# Altium project link_b.PrjPcb
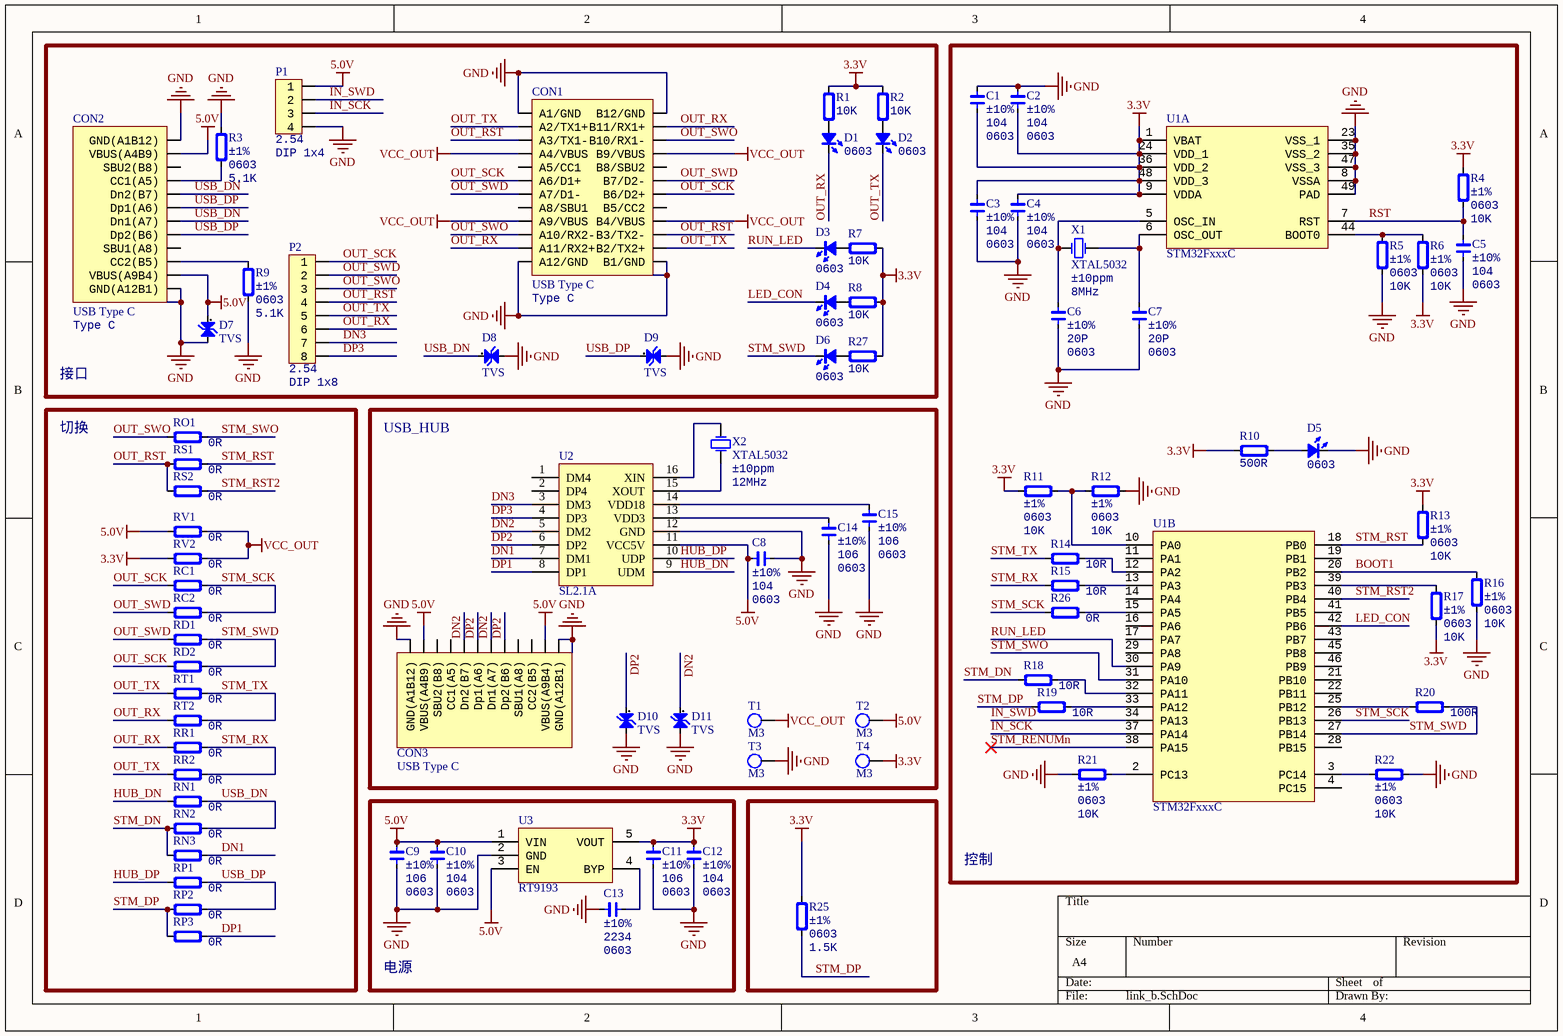
[diagram p0: link_b.SchDoc]
1 sheet, 84 parts. Net scope: global (net labels, ports and power ports of the same name join across sheets).
Board file: link_b.PcbDoc

## Sheet link_b.SchDoc
size A4

### Parts
C1  value 104  Note: ±10%  Type: 0603  [CAP_0603]  (hidden comment: C0603)
C2  value 104  Note: ±10%  Type: 0603  [CAP_0603]  (hidden comment: C0603)
C3  value 104  Note: ±10%  Type: 0603  [CAP_0603]  (hidden comment: C0603)
C4  value 104  Note: ±10%  Type: 0603  [CAP_0603]  (hidden comment: C0603)
C5  value 104  Note: ±10%  Type: 0603  [CAP_0603]  (hidden comment: C0603)
C6  value 20P  Note: ±10%  Type: 0603  [CAP_0603]  (hidden comment: C0603)
C7  value 20P  Note: ±10%  Type: 0603  [CAP_0603]  (hidden comment: C0603)
C8  value 104  Note: ±10%  Type: 0603  [CAP_0603]  (hidden comment: C0603)
C9  value 106  Note: ±10%  Type: 0603  [CAP_0603]  (hidden comment: C0603)
C10  value 104  Note: ±10%  Type: 0603  [CAP_0603]  (hidden comment: C0603)
C11  value 106  Note: ±10%  Type: 0603  [CAP_0603]  (hidden comment: C0603)
C12  value 104  Note: ±10%  Type: 0603  [CAP_0603]  (hidden comment: C0603)
C13  value 2234  Note: ±10%  Type: 0603  [CAP_0603]  (hidden comment: C0603)
C14  value 106  Note: ±10%  Type: 0603  [CAP_0603]  (hidden comment: C0603)
C15  value 106  Note: ±10%  Type: 0603  [CAP_0603]  (hidden comment: C0603)
CON1  USB Type C  value Type C  [USB_TypeC_SMD_24P]
CON2  USB Type C  value Type C  [USB_TypeC_SMD_16P]
CON3  USB Type C  [USB_TypeC_SMD_16P]
D1  Type: 0603  [LED_0603_RED]  (hidden comment: D0603)
D2  Type: 0603  [LED_0603_RED]  (hidden comment: D0603)
D3  Type: 0603  [LED_0603_RED]  (hidden comment: D0603)
D4  Type: 0603  [LED_0603_RED]  (hidden comment: D0603)
D5  Type: 0603  [LED_0603_RED]  (hidden comment: D0603)
D6  Type: 0603  [LED_0603_RED]  (hidden comment: D0603)
D7  TVS  [LED_0603_YELLOW]
D8  TVS  [LED_0603_YELLOW]
D9  TVS  [LED_0603_YELLOW]
D10  TVS  [LED_0603_YELLOW]
D11  TVS  [LED_0603_YELLOW]
P1  value 2.54  Type: DIP 1x4  [HDR1x4_TOP]  (hidden comment: HDR1x4)
P2  value 2.54  Type: DIP 1x8  [HDR1x8_TOP]  (hidden comment: HDR1x8)
R1  value 10K  [RES_0603]  (hidden comment: R0603)
R2  value 10K  [RES_0603]  (hidden comment: R0603)
R3  value 5.1K  Note: ±1%  Type: 0603  [RES_0603]  (hidden comment: R0603)
R4  value 10K  Note: ±1%  Type: 0603  [RES_0603]  (hidden comment: R0603)
R5  value 10K  Note: ±1%  Type: 0603  [RES_0603]  (hidden comment: R0603)
R6  value 10K  Note: ±1%  Type: 0603  [RES_0603]  (hidden comment: R0603)
R7  value 10K  [RES_0603]  (hidden comment: R0603)
R8  value 10K  [RES_0603]  (hidden comment: R0603)
R9  value 5.1K  Note: ±1%  Type: 0603  [RES_0603]  (hidden comment: R0603)
R10  value 500R  [RES_0603]  (hidden comment: R0603)
R11  value 10K  Note: ±1%  Type: 0603  [RES_0603]  (hidden comment: R0603)
R12  value 10K  Note: ±1%  Type: 0603  [RES_0603]  (hidden comment: R0603)
R13  value 10K  Note: ±1%  Type: 0603  [RES_0603]  (hidden comment: R0603)
R14  value 10R  [RES_0603]  (hidden comment: R0603)
R15  value 10R  [RES_0603]  (hidden comment: R0603)
R16  value 10K  Note: ±1%  Type: 0603  [RES_0603]  (hidden comment: R0603)
R17  value 10K  Note: ±1%  Type: 0603  [RES_0603]  (hidden comment: R0603)
R18  value 10R  [RES_0603]  (hidden comment: R0603)
R19  value 10R  [RES_0603]  (hidden comment: R0603)
R20  value 100R  [RES_0603]  (hidden comment: R0603)
R21  value 10K  Note: ±1%  Type: 0603  [RES_0603]  (hidden comment: R0603)
R22  value 10K  Note: ±1%  Type: 0603  [RES_0603]  (hidden comment: R0603)
R25  value 1.5K  Note: ±1%  Type: 0603  [RES_0603]  (hidden comment: R0603)
R26  value 0R  [RES_0603]  (hidden comment: R0603)
R27  value 10K  [RES_0603]  (hidden comment: R0603)
RC1  value 0R  [RES_0603]  (hidden comment: R0603)
RC2  value 0R  [RES_0603]  (hidden comment: R0603)
RD1  value 0R  [RES_0603]  (hidden comment: R0603)
RD2  value 0R  [RES_0603]  (hidden comment: R0603)
RN1  value 0R  [RES_0603]  (hidden comment: R0603)
RN2  value 0R  [RES_0603]  (hidden comment: R0603)
RN3  value 0R  [RES_0603]  (hidden comment: R0603)
RO1  value 0R  [RES_0603]  (hidden comment: R0603)
RP1  value 0R  [RES_0603]  (hidden comment: R0603)
RP2  value 0R  [RES_0603]  (hidden comment: R0603)
RP3  value 0R  [RES_0603]  (hidden comment: R0603)
RR1  value 0R  [RES_0603]  (hidden comment: R0603)
RR2  value 0R  [RES_0603]  (hidden comment: R0603)
RS1  value 0R  [RES_0603]  (hidden comment: R0603)
RS2  value 0R  [RES_0603]  (hidden comment: R0603)
RT1  value 0R  [RES_0603]  (hidden comment: R0603)
RT2  value 0R  [RES_0603]  (hidden comment: R0603)
RV1  value 0R  [RES_0603]  (hidden comment: R0603)
RV2  value 0R  [RES_0603]  (hidden comment: R0603)
T1  M3  [M3]
T2  M3  [M3]
T3  M3  [M3]
T4  M3  [M3]
U1  STM32FxxxC  [LQFP_QNF_48]  (parts A,B of 2)
U2  SL2.1A  [SOP16]
U3  RT9193  [SOT23-5]
X1  XTAL5032  value 8MHz  Specification: ±10ppm  [XT_5032_2]
X2  XTAL5032  value 12MHz  Specification: ±10ppm  [XT_5032_2]

### Blocks framed on the sheet
接口: CON1 CON2 D1-D4 D6-D9 P1 P2 R1-R3 R7-R9 R27
控制: C1-C7 D5 R4-R6 R10-R22 R26 U1 X1
切换: RC1 RC2 RD1 RD2 RN1-RN3 RO1 RP1-RP3 RR1 RR2 RS1 RS2 RT1 RT2 RV1 RV2
USB_HUB: C8 C14 C15 CON3 D10 D11 T1-T4 U2 X2
电源: C9-C13 U3

### Nets
3.3V: C1.1 C2.1 C3.2 C4.2 C11.2 C12.2 R1.1 R2.1 R4.2 R6.1 R7.1 R8.1 R10.1 R11.2 R13.2 R17.2 R25.2 R27.1 RV2.2 T4.1 U1.1(VBAT) U1.9(VDDA) U1.24(VDD_1) U1.36(VDD_2) U1.48(VDD_3) U3.5(VOUT)
5.0V: C8.2 C9.2 C10.2 CON2.A4B9(VBUS(A4B9)) CON2.A9B4(VBUS(A9B4)) CON3.A4B9(VBUS(A4B9)) CON3.A9B4(VBUS(A9B4)) D7.1(A) P1.1 RV1.2 T2.1 U2.11(VCC5V) U3.1(VIN) U3.3(EN)
GND: C1.2 C2.2 C3.1 C4.1 C5.1 C6.1 C7.1 C8.1 C9.1 C10.1 C11.1 C12.1 C13.1 C14.2 C15.2 CON1.0(SH) CON1.A1(A1/GND) CON1.A12(A12/GND) CON1.B1(B1/GND) CON1.B12(B12/GND) CON2.0(SH) CON2.A1B12(GND(A1B12)) CON2.A12B1(GND(A12B1)) CON3.0(SH) CON3.A1B12(GND(A1B12)) CON3.A12B1(GND(A12B1)) D5.2(K) D7.2(K) D8.2(K) D9.2(K) D10.2(K) D11.2(K) P1.4 R3.2 R5.1 R9.1 R12.1 R16.2 R21.1 R22.2 T3.1 U1.8(VSSA) U1.23(VSS_1) U1.35(VSS_2) U1.47(VSS_3) U1.49(PAD) U2.12(GND) U3.2(GND)
VCC_OUT: CON1.A4(A4/VBUS) CON1.A9(A9/VBUS) CON1.B4(B4/VBUS) CON1.B9(B9/VBUS) RV1.1 RV2.1 T1.1
BOOT1: R16.1 U1.20(PB2)
DN1: RN3.1 U2.7(DM1)
DN2: CON3.A7(Dn1(A7)) CON3.B7(Dn2(B7)) D11.1(A) U2.5(DM2)
DN3: P2.7 U2.3(DM3)
DP1: RP3.1 U2.8(DP1)
DP2: CON3.A6(Dp1(A6)) CON3.B6(Dp2(B6)) D10.1(A) U2.6(DP2)
DP3: P2.8 U2.4(DP3)
HUB_DN: RN1.2 U2.9(UDM)
HUB_DP: RP1.2 U2.10(UDP)
IN_SCK: P1.3 U1.37(PA14)
IN_SWD: P1.2 U1.34(PA13)
LED_CON: D4.2(K) U1.42(PB6)
OUT_RST: CON1.A3(A3/TX1-) CON1.B3(B3/TX2-) P2.4 RS1.2 RS2.2
OUT_RX: CON1.A11(A11/RX2+) CON1.B11(B11/RX1+) D1.2(K) P2.6 RR1.2 RT2.2
OUT_SCK: CON1.A6(A6/D1+) CON1.B6(B6/D2+) P2.1 RC1.2 RD2.2
OUT_SWD: CON1.A7(A7/D1-) CON1.B7(B7/D2-) P2.2 RC2.2 RD1.2
OUT_SWO: CON1.A10(A10/RX2-) CON1.B10(B10/RX1-) P2.3 RO1.2
OUT_TX: CON1.A2(A2/TX1+) CON1.B2(B2/TX2+) D2.2(K) P2.5 RR2.2 RT1.2
RST: C5.2 R4.1 U1.7(RST)
RUN_LED: D3.2(K) U1.30(PA9)
STM_DN: R18.2 RN2.2 RN3.2
STM_DP: R19.2 R25.1 RP2.2 RP3.2
STM_RENUMn: U1.38(PA15)
STM_RST: R13.1 RS1.1 U1.18(PB0)
STM_RST2: RS2.1 U1.40(PB4)
STM_RX: R15.2 RR1.1 RR2.1
STM_SCK: R26.2 RC1.1 RC2.1 U1.26(PB13)
STM_SWD: D6.2(K) R20.1 RD1.1 RD2.1 U1.27(PB14)
STM_SWO: RO1.1 U1.31(PA10)
STM_TX: R14.2 RT1.1 RT2.1
USB_DN: CON2.A7(Dn1(A7)) CON2.B7(Dn2(B7)) D8.1(A) RN1.1 RN2.1
USB_DP: CON2.A6(Dp1(A6)) CON2.B6(Dp2(B6)) D9.1(A) RP1.1 RP2.1
NetC6_2: C6.2 U1.5(OSC_IN) X1.1(OSC1)
NetC7_2: C7.2 U1.6(OSC_OUT) X1.2(OSC2)
NetC13_2: C13.2 U3.4(BYP)
NetC14_1: C14.1 U2.13(VDD3)
NetC15_1: C15.1 U2.14(VDD18)
NetCON2_A5: CON2.A5(CC1(A5)) R3.1
NetCON2_B5: CON2.B5(CC2(B5)) R9.2
NetD1_1: D1.1(A) R1.2
NetD2_1: D2.1(A) R2.2
NetD3_1: D3.1(A) R7.2
NetD4_1: D4.1(A) R8.2
NetD5_1: D5.1(A) R10.2
NetD6_1: D6.1(A) R27.2
NetR5_2: R5.2 R6.2 U1.44(BOOT0)
NetR11_1: R11.1 R12.2 U1.10(PA0)
NetR14_1: R14.1 U1.12(PA2)
NetR15_1: R15.1 U1.13(PA3)
NetR17_1: R17.1 U1.39(PB3)
NetR18_1: R18.1 U1.32(PA11)
NetR19_1: R19.1 U1.33(PA12)
NetR20_2: R20.2 U1.25(PB12)
NetR21_2: R21.2 U1.2(PC13)
NetR22_1: R22.1 U1.3(PC14)
NetR26_1: R26.1 U1.15(PA5)
NetU2_15: U2.15(XOUT) X2.1(OSC1)
NetU2_16: U2.16(XIN) X2.2(OSC2)

Not connected (* = marked no-connect by the designer): CON1 A5(A5/CC1) A8(A8/SBU1) B5(B5/CC2) B8(B8/SBU2); CON2 A8(SBU1(A8)) B8(SBU2(B8)); CON3 A5(CC1(A5)) A8(SBU1(A8)) B5(CC2(B5)) B8(SBU2(B8)); U1 4(PC15) 11(PA1) 14(PA4) 16(PA6) 17(PA7) 19(PB1) 21(PB10) 22(PB11) 28(PB15) 29(PA8) 41(PB5) 43(PB7) 45(PB8) 46(PB9); U2 1(DM4) 2(DP4)

### Library data of the parts
C1-C15 = Cap_0603: Capacitor; Specification: X7R, ±10%, 16V; Manufacturer: *
CON1 = USB_TypeC: USB; Type: *
CON2 = USB_TypeC_16P: USB; Type: *
CON3 = USB_TypeC_16P: USB; Value: Type C; Type: *
D1-D6 = LED_0603: LED; Value: color?; Manufacturer: *; Specification: *; Note: *
D7-D11 = ESD LESD5D5.0CT1G: 静电保护二极管,VRWM=5V.IPP=9.4A
P1 = HDR1x4_2.54TOP: Header Top
P2 = HDR1x8_2.54TOP: Header Top
R1 R2 R7 R8 R10 R14 R15 R18-R20 R26 R27 RC1 RC2 RD1 RD2 RN1-RN3 RO1 RP1-RP3 RR1 RR2 RS1 RS2 RT1 RT2 RV1 RV2 = Res_0603: Resistor; Specification: ±1%; Manufacturer: *; Note: ±1%; Type: 0603
R3-R6 R9 R11-R13 R16 R17 R21 R22 R25 = Res_0603: Resistor; Manufacturer: *; Specification: ±1%
T1-T4 = M3: M3 Nut
U1 = STM32FxxxC: MCU ST; Manufacturer: STMicroelectronics; Note: CortexM3; Type: LQFP48 P0.5; Specification: *; Value: *
U2 = SL2.1A: USB HUB
U3 = RT9193: Power; Value: 3V3; Type: SOT23-5; Manufacturer: *; Specification: *; Note: *
X1 X2 = XTAL_5032_2P: Crystal Oscillator; Type: XTAL5032_2P; Manufacturer: *; Note: *